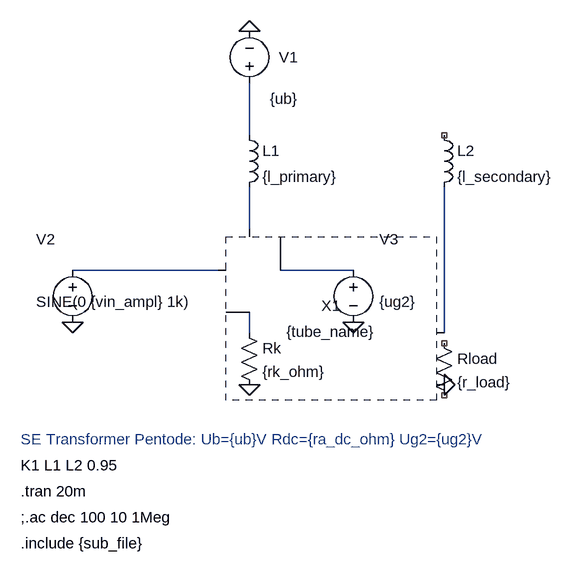
[diagram p0: schematic amp_se_xfmr_pentode.asc]
amp_se_xfmr_pentode.asc, the LTspice schematic file:
Version 4
SHEET 1 1400 1000
WIRE 400 112 400 192
WIRE 400 272 400 336
WIRE 128 400 352 400
WIRE 448 400 560 400
WIRE 400 464 400 496
WIRE 700 272 700 496
FLAG 400 32 0
FLAG 128 480 0
FLAG 400 576 0
FLAG 560 480 0
FLAG 700 576 0
SYMBOL voltage 400 128 R180
WINDOW 0 -75 56 Left 2
WINDOW 3 -75 -8 Left 2
SYMATTR InstName V1
SYMATTR Value {ub}
SYMBOL voltage 128 384 R0
WINDOW 0 -56 -32 Left 2
WINDOW 3 -56 64 Left 2
SYMATTR InstName V2
SYMATTR Value SINE(0 {vin_ampl} 1k)
SYMBOL voltage 560 384 R0
WINDOW 0 40 -32 Left 2
WINDOW 3 40 64 Left 2
SYMATTR InstName V3
SYMATTR Value {ug2}
SYMBOL {tube_name} 400 400 R0
SYMATTR InstName X1
SYMATTR Value {tube_name}
SYMBOL ind 384 176 R0
SYMATTR InstName L1
SYMATTR Value {l_primary}
SYMATTR SpiceLine Rser={ra_dc_ohm}
SYMBOL ind 684 176 R0
SYMATTR InstName L2
SYMATTR Value {l_secondary}
SYMBOL res 684 496 R0
SYMATTR InstName Rload
SYMATTR Value {r_load}
SYMBOL res 384 480 R0
SYMATTR InstName Rk
SYMATTR Value {rk_ohm}
TEXT 48 700 Left 2 !K1 L1 L2 0.95
TEXT 48 740 Left 2 !.tran 20m
TEXT 48 780 Left 2 !;.ac dec 100 10 1Meg
TEXT 48 820 Left 2 !.include {sub_file}
TEXT 48 660 Left 2 ;SE Transformer Pentode: Ub={ub}V Rdc={ra_dc_ohm} Ug2={ug2}V

The netlist it stands for:
* amp_se_xfmr_pentode.asc
V1 N001 0 {ub}
V2 N003 0 SINE(0 {vin_ampl} 1k)
V3 N004 0 {ug2}
* X1: {tube_name} (symbol {tube_name} not available, pin order unknown); nets seen at it: 0, N002, N003, N004, N005, N006
L1 N001 N002 {l_primary} Rser={ra_dc_ohm}
L2 NC_01 N006 {l_secondary}
Rload NC_02 NC_03 {r_load}
Rk N005 0 {rk_ohm}
K1 L1 L2 0.95
.tran 20m
;.ac dec 100 10 1Meg
.include {sub_file}
* SE Transformer Pentode: Ub={ub}V Rdc={ra_dc_ohm} Ug2={ug2}V
.backanno
.end